# EAGLE design MotorController (EAGLE 9.5.2)
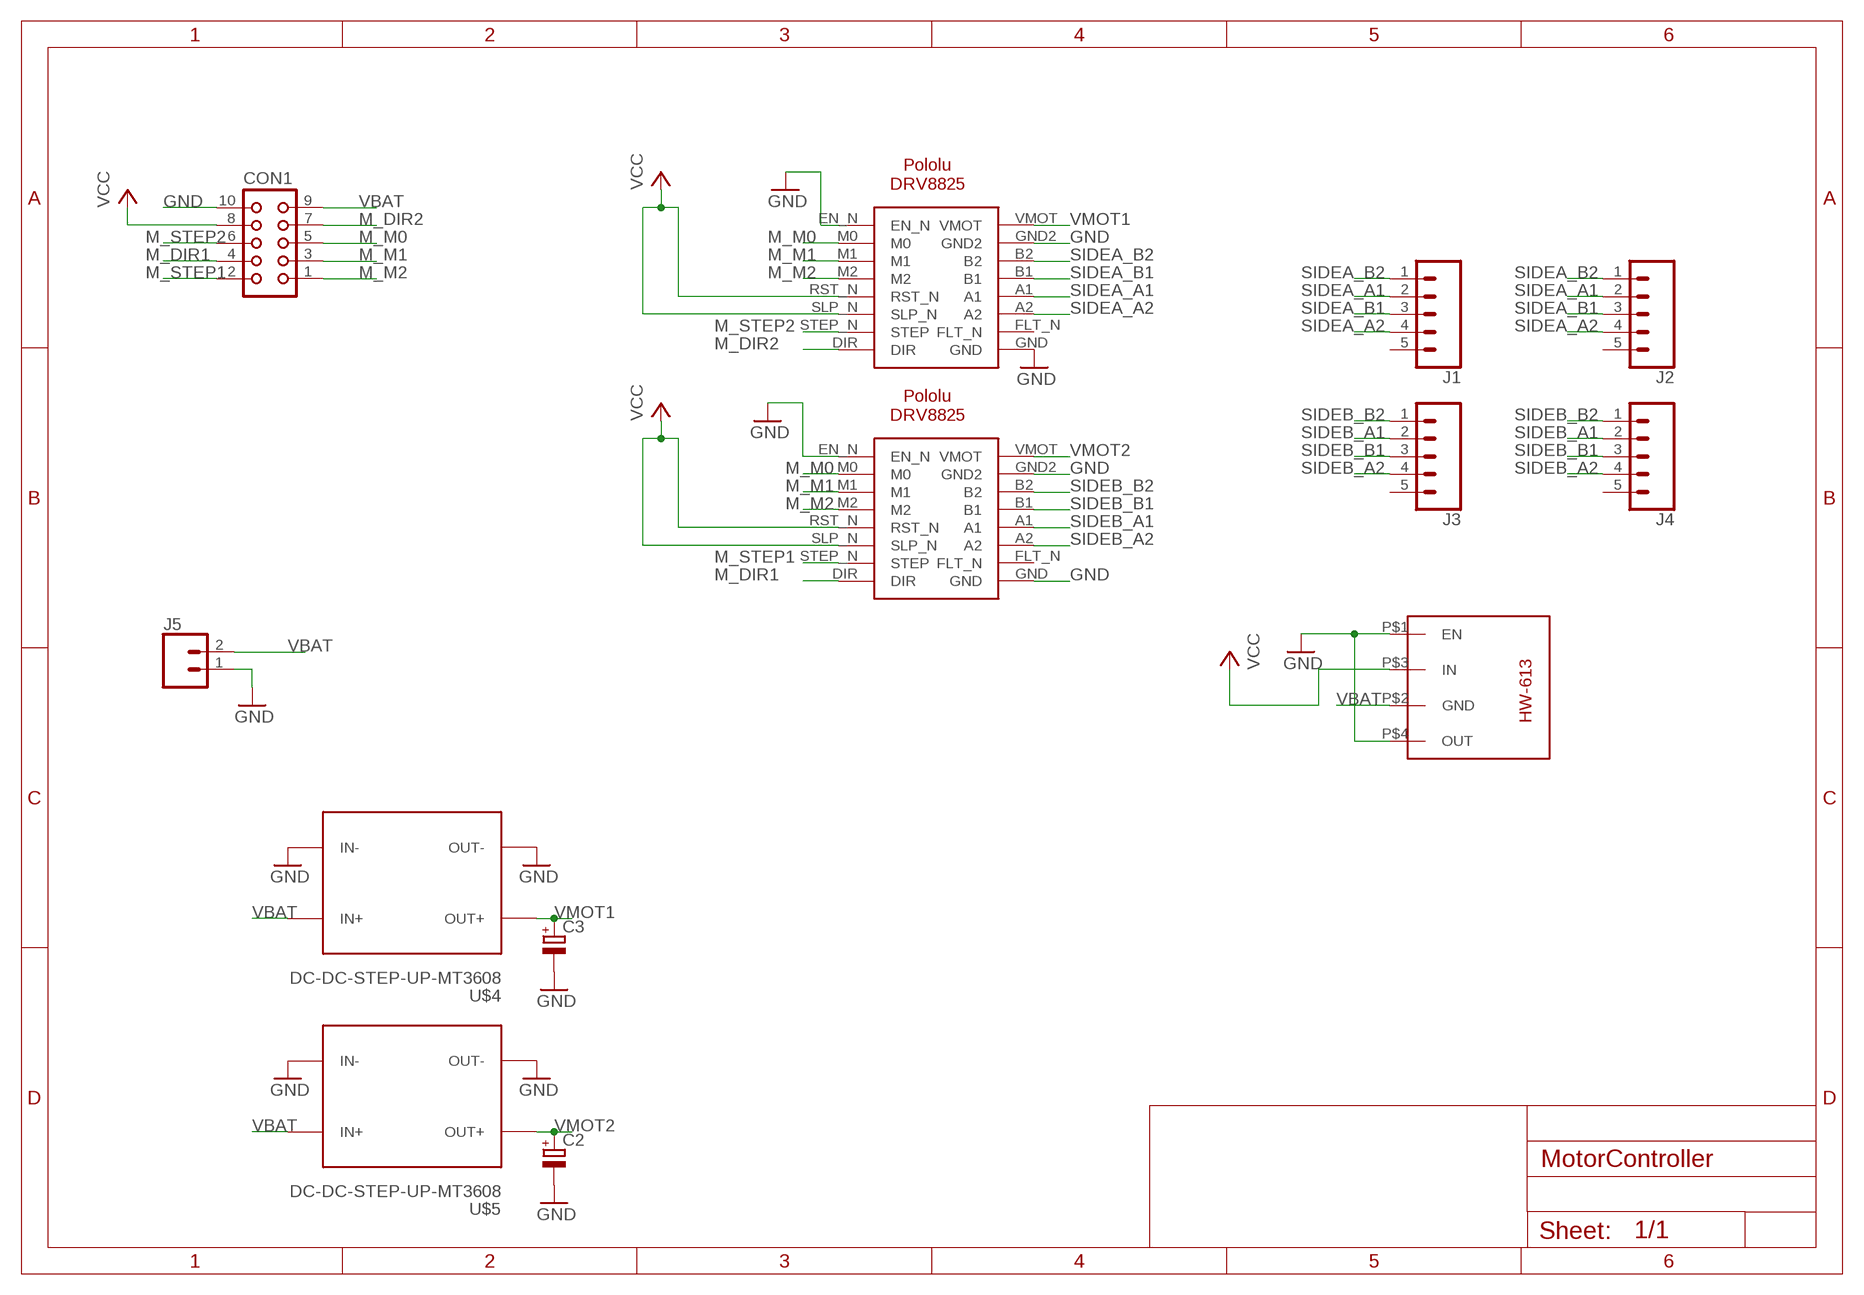
[diagram p0: schematic, sheet 1]

## Parts
C2  CPOL-EUE3.5-10  [E3,5-10]
C3  CPOL-EUE3.5-10  [E3,5-10]
CON1  CON10  [CON10]
J1  CONN_05  [1X05]
J2  CONN_05  [1X05]
J3  CONN_05  [1X05]
J4  CONN_05  [1X05]
J5  CONN_025MM  [SCREWTERMINAL-5MM-2]
U$1  POLOLU-DRV8825  [POLOLU-DRV8825]
U$2  POLOLU-DRV8825  [POLOLU-DRV8825]
U$4  DC-DC-STEP-UP-MT3608  [DC-DC-STEP-UP-MT3608]
U$5  DC-DC-STEP-UP-MT3608  [DC-DC-STEP-UP-MT3608]
U$6  HW-613  [HW-613]

## Nets
GND: C2.- C3.- CON1.10 J5.1 U$1.EN_N U$1.GND U$1.GND2 U$2.EN_N U$2.GND U$2.GND2 U$4.IN- U$4.OUT- U$5.IN- U$5.OUT- U$6.P$1(EN) U$6.P$4(OUT)
M_DIR1: CON1.4 U$2.DIR
M_DIR2: CON1.7 U$1.DIR
M_M0: CON1.5 U$1.M0 U$2.M0
M_M1: CON1.3 U$1.M1 U$2.M1
M_M2: CON1.1 U$1.M2 U$2.M2
M_STEP1: CON1.2 U$2.STEP_N(STEP)
M_STEP2: CON1.6 U$1.STEP_N(STEP)
SIDEA_A1: J1.2 J2.2 U$1.A1
SIDEA_A2: J1.4 J2.4 U$1.A2
SIDEA_B1: J1.3 J2.3 U$1.B1
SIDEA_B2: J1.1 J2.1 U$1.B2
SIDEB_A1: J3.2 J4.2 U$2.A1
SIDEB_A2: J3.4 J4.4 U$2.A2
SIDEB_B1: J3.3 J4.3 U$2.B1
SIDEB_B2: J3.1 J4.1 U$2.B2
VBAT: CON1.9 J5.2 U$4.IN+ U$5.IN+ U$6.P$2(GND)
VCC: CON1.8 U$1.RST_N U$1.SLP_N U$2.RST_N U$2.SLP_N U$6.P$3(IN)
VMOT1: C3.+ U$1.VMOT U$4.OUT+
VMOT2: C2.+ U$2.VMOT U$5.OUT+
Unconnected: J1.5 J2.5 J3.5 J4.5 U$1.FLT_N U$2.FLT_N

## Library data of the parts
C2 C3 = rcl:CPOL-EU: POLARIZED CAPACITOR, European symbol; SPICEPREFIX: C
CON1 = con-harting:CON10: CONNECTOR; OC_FARNELL: unknown; OC_NEWARK: unknown
J1-J4 = custom:CONN_05: Multi connection point. Often used as Generic Header-pin footprint for 0.1 inch spaced/style header connections On any of the 0.1 inch spaced packages, you can populate with these: Break Away Headers - Straight <https://www.sparkfun.com/products/116> (PRT-00116) Break Away Male Headers - Right Angle <https://www.sparkfun.com/products/553> (PRT-00553) Female Headers <https://www.sparkfun.com/products/115> (PRT-00115) Break Away Headers - Machine Pin <https://www.sparkfun.com/products/117> (PRT-00117) Break Away Female Headers - Swiss Machine Pin <https://www.sparkfun.com/products/743> (PRT-00743) For SCREWTERMINALS and SPRING TERMINALS visit here: Screw Terimnals on SparkFun.com <https://www.sparkfun.com/search/results?term=Screw+Terminals> (5mm/3.5mm/2.54mm spacing) This device is also useful as a general connection point to wire up your design to another part of your project. Our various solder wires solder well into these plated through hole pads. Hook-Up Wire - Assortment (Stranded, 22 AWG) <https://www.sparkfun.com/products/11375> (PRT-11375) Hook-Up Wire - Assortment (Solid Core, 22 AWG) <https://www.sparkfun.com/products/11367> (PRT-11367) View the entire wire category on our website here <https://www.sparkfun.com/categories/141> Special notes: Molex polarized connector foot print use with SKU : PRT-08231 with associated crimp pins and housings. 1MM SMD Version SKU: PRT-10208
J5 = SparkFun-Connectors:CONN_02: Multi connection point. Often used as Generic Header-pin footprint for 0.1 inch spaced/style header connections On any of the 0.1 inch spaced packages, you can populate with these: Break Away Headers - Straight <https://www.sparkfun.com/products/116> (PRT-00116) Break Away Male Headers - Right Angle <https://www.sparkfun.com/products/553> (PRT-00553) Female Headers <https://www.sparkfun.com/products/115> (PRT-00115) Break Away Headers - Machine Pin <https://www.sparkfun.com/products/117> (PRT-00117) Break Away Female Headers - Swiss Machine Pin <https://www.sparkfun.com/products/743> (PRT-00743) For SCREWTERMINALS and SPRING TERMINALS visit here: Screw Terimnals on SparkFun.com <https://www.sparkfun.com/search/results?term=Screw+Terminals> (5mm/3.5mm/2.54mm spacing) This device is also useful as a general connection point to wire up your design to another part of your project. Our various solder wires solder well into these plated through hole pads. Hook-Up Wire - Assortment (Stranded, 22 AWG) <https://www.sparkfun.com/products/11375> (PRT-11375) Hook-Up Wire - Assortment (Solid Core, 22 AWG) <https://www.sparkfun.com/products/11367> (PRT-11367) View the entire wire category on our website here <https://www.sparkfun.com/categories/141> Special notes: Molex polarized connector foot print use with: PRT-08233 with associated crimp pins and housings. 2.54_SCREWTERM for use with PRT-10571. 3.5mm Screw Terminal footprints for PRT-08084 5mm Screw Terminal footprints for use with PRT-08432; SF_SKU: PRT-08432
U$1 U$2 = alvarop-lib:POLOLU-DRV8825
U$4 U$5 = diy-modules:DC-DC-STEP-UP-MT3608: DC/DC Step-Up Regulator based on MT3608 chip MT3608 datasheet available here: https://www.olimex.com/Products/Breadboarding/BB-PWR-3608/resources/MT3608.pdf Click here to find device on ebay.com <http://www.ebay.com/sch/mt3608+module>
U$6 = mam2020:HW-613

## Board
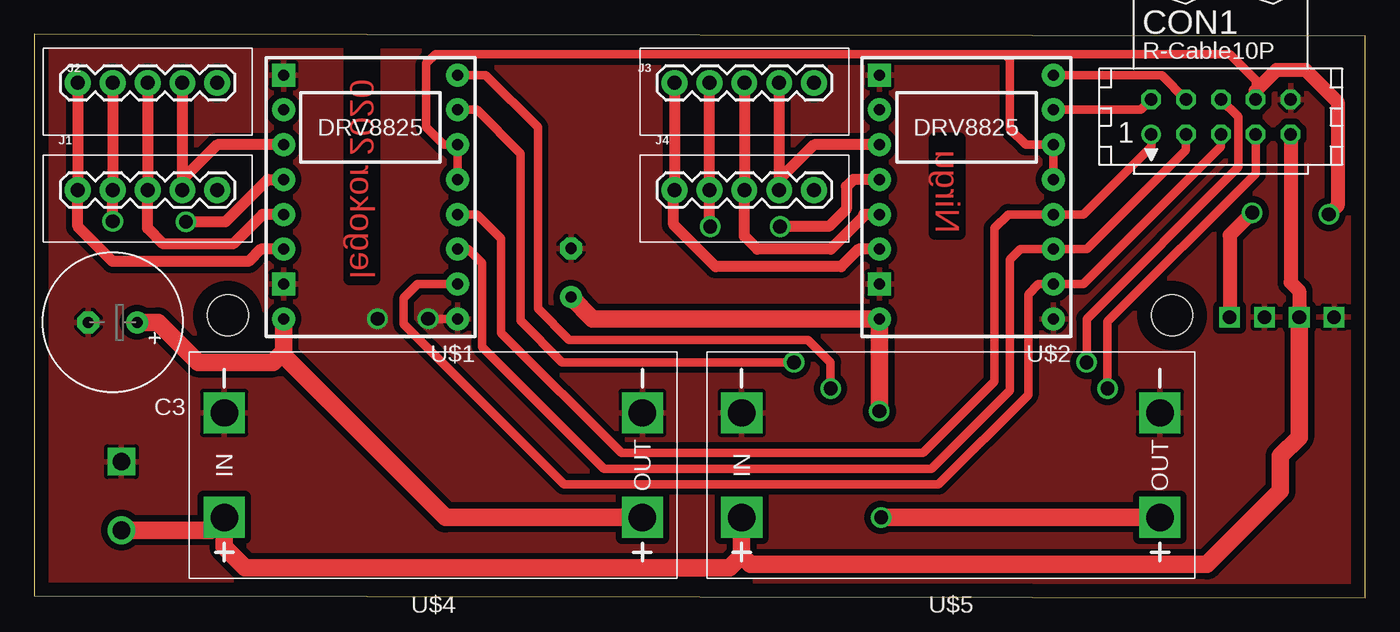
[diagram p1: board, top side]
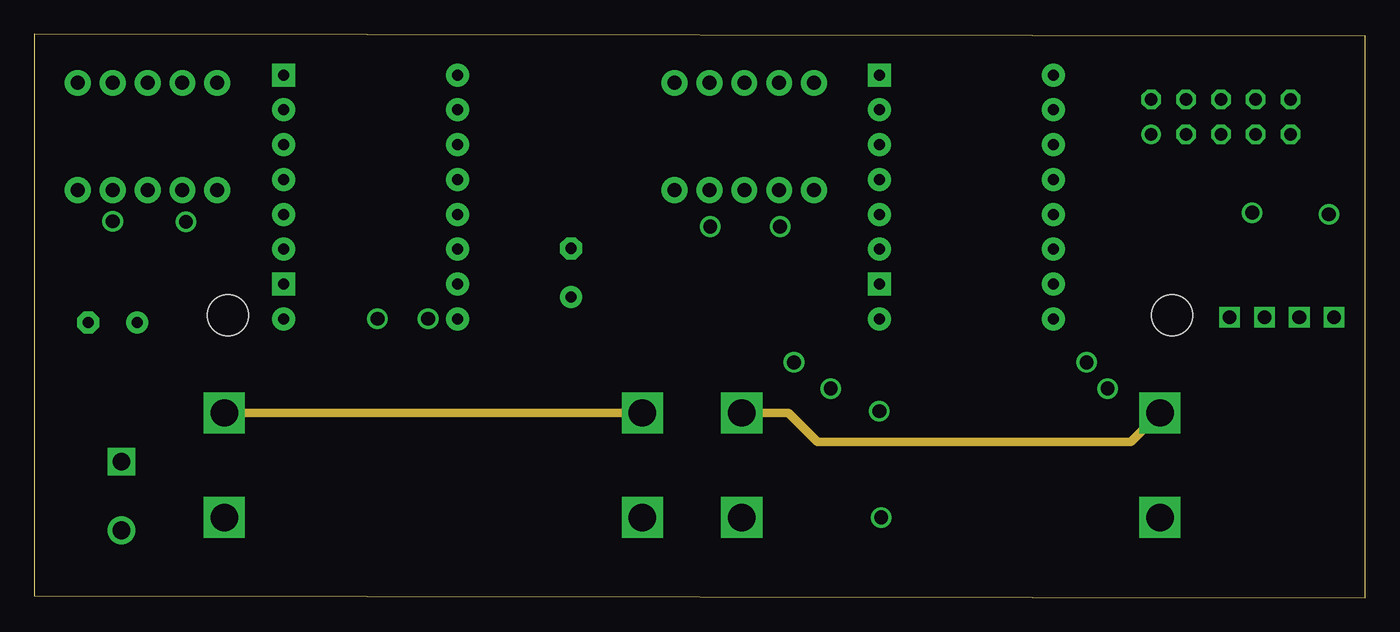
[diagram p2: board, inner layer Route15]
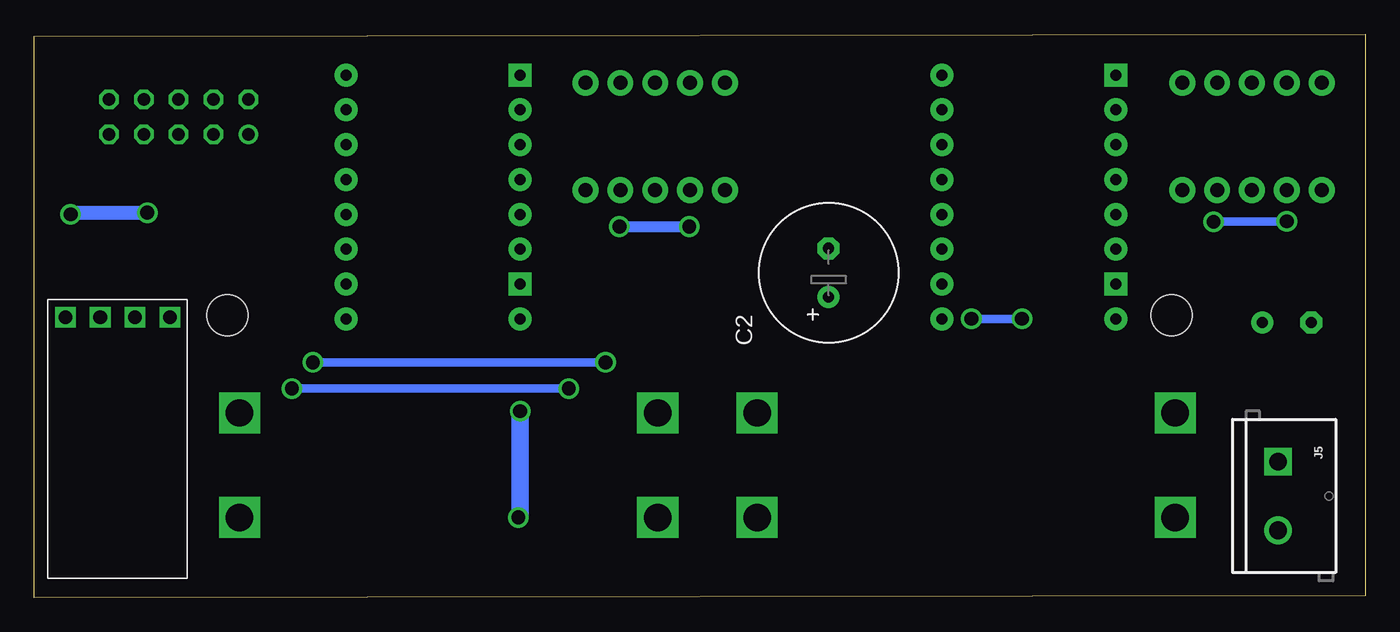
[diagram p3: board, bottom side, seen from below]

Size 97.01 x 41.07 mm. Coordinates in mm from the lower left corner, seen from the top.
Outline: 0,0.13 97.01,0 97.01,40.95 0,41.07 0,0.13
Copper layers (1+2*15+16): Top 0.035mm / dielectric 1.5mm / Route2 0.035mm / dielectric 0.15mm / Route15 0.035mm / dielectric 0.2mm / Bottom 0.035mm
Design rules "default *": minimum track width 6mil, minimum drill 0.35mm, track to track 18mil, track to pad 10mil, pad to pad 6mil, via to via 6mil, smd to smd 6mil, copper to edge 40mil, drill to drill 6mil, minimum pad ring 10mil, minimum via ring 8mil, stop-mask expansion 4mil, vias tented up to drill 0mil, thermal gap 10mil
Holes 3 mm at 14.1,20.57 82.93,20.57

### Footprints (pad centres in the part's own frame; a part is rotated, then mirrored left to right if it is on the bottom)
E3,5-10 = drill 0.813 pad 1.6: + -1.778,0 | drill 0.813 pad 1.6 octagon: - 1.778,0
CON10 = drill 0.914: 1 -5.08,-1.27 | drill 0.914 octagon: 2 -5.08,1.27; 3 -2.54,-1.27; 4 -2.54,1.27; 5 0,-1.27; 6 0,1.27; 7 2.54,-1.27; 8 2.54,1.27; 9 5.08,-1.27; 10 5.08,1.27
1X05 = drill 1.016 pad 1.88: 1 0,0; 2 2.54,0; 3 5.08,0; 4 7.62,0; 5 10.16,0
SCREWTERMINAL-5MM-2 = drill 1.3 pad 2.032 square: 1 0,0 | drill 1.3 pad 2.032: 2 5,0
POLOLU-DRV8825 = drill 0.8 pad 1.676: A1 6.35,-1.27; A2 6.35,-3.81; B1 6.35,1.27; B2 6.35,3.81; DIR -6.35,-8.89; EN_N -6.35,8.89; FLT_N 6.35,-6.35; M0 -6.35,6.35; M1 -6.35,3.81; M2 -6.35,1.27; RST_N -6.35,-1.27; SLP_N -6.35,-3.81; STEP_N -6.35,-6.35; VMOT 6.35,8.89 | drill 0.8 pad 1.676 square: GND 6.35,-8.89; GND2 6.35,6.35
DC-DC-STEP-UP-MT3608 = drill 2 pad 2.8 square: IN+ 15.24,3.81; IN- 15.24,-3.81; OUT+ -15.24,3.81; OUT- -15.24,-3.81
HW-613 = drill 1 square: P$1 0,1.27; P$2 0,-1.27; P$3 0,3.81; P$4 0,-3.81

### Placement (x,y rotation side)
C2  39.12,23.69 90 bottom
C3  5.71,20.07 180 top
CON1  86.49,35.05 0 top
J1  3.18,29.72 0 top
J2  3.18,37.53 0 top
J3  46.67,37.53 0 top
J4  46.67,29.72 0 top
J5  6.35,9.91 270 bottom
U$1  24.51,29.21 180 top
U$2  67.95,29.21 180 top
U$4  29.08,9.65 180 top
U$5  66.8,9.65 180 top
U$6  90.93,20.45 270 bottom

### Tracks (layer width: path | path; a pad name or v marks a point on that pad's centre or on a via)
GND  (via drill 1)
  Top 0.61: U$1.EN_N v28.7,20.32
  Route15 0.61: U$4.IN- U$4.OUT- | U$5.IN- 54.97,13.46 57.09,11.34 79.92,11.34 U$5.OUT-
  Bottom 0.61: v28.7,20.32 v25.02,20.32
  pour Top: 0.1,41.15 97.28,41.15 97.28,0.13 0,0.13 0,41.25
M_DIR1
  Top 0.61: CON1.4 82.17,38.1 U$2.DIR
M_DIR2  (via drill 1)
  Top 0.61: CON1.7 89.03,30.91 78.23,20.12 v78.23,15.24 | v58.04,15.24 58.04,17.14 56.39,18.8 38.99,18.8 36.7,21.08 36.7,34.29 32.89,38.1 U$1.DIR
  Bottom 0.61: v78.23,15.24 v58.04,15.24
M_M0
  Top 0.61: CON1.5 86.49,32.89 76.45,22.86 U$2.M0 73.2,22.86 72.44,22.1 72.44,14.78 65.91,8.26 38.61,8.26 26.92,19.94 26.92,21.84 27.94,22.86 U$1.M0
M_M1
  Top 0.61: CON1.3 83.95,32.64 76.71,25.4 U$2.M1 71.88,25.4 71.12,24.64 71.12,15.11 65.41,9.4 41.53,9.4 32.64,18.29 32.64,24.38 31.62,25.4 U$1.M1
M_M2
  Top 0.61: CON1.1 81.41,32.89 76.45,27.94 U$2.M2 70.99,27.94 69.98,26.92 69.98,15.75 64.77,10.54 42.8,10.54 34.04,19.3 34.04,26.16 32.26,27.94 U$1.M2
M_STEP1
  Top 0.61: U$2.STEP_N 80.64,35.56 CON1.2
M_STEP2  (via drill 1)
  Top 0.61: U$1.STEP_N 32.26,35.56 35.43,32.38 35.43,20.19 38.48,17.14 v55.37,17.14 | CON1.6 87.76,35.05 87.76,31.37 76.71,20.32 v76.71,17.14
  Bottom 0.61: v76.71,17.14 v55.37,17.14
SIDEA_A1  (via drill 1)
  Top 0.813: J2.2 J1.2 v5.71,27.43 | v11.05,27.4 13.94,27.4 17.02,30.48 U$1.A1
  Bottom 0.61: v11.05,27.4 5.75,27.4 v5.71,27.43
SIDEA_A2
  Top 0.813: J2.4 J1.4 10.79,30.48 13.34,33.02 U$1.A2
SIDEA_B1
  Top 0.813: J2.3 J1.3 8.25,26.92 9.4,25.78 14.48,25.78 16.64,27.94 U$1.B1
SIDEA_B2
  Top 0.813: J2.1 J1.1 3.18,27.05 5.71,24.51 15.62,24.51 16.51,25.4 U$1.B2
SIDEB_A1  (via drill 1)
  Top 0.813: J3.2 J4.2 49.21,27.11 v49.28,27.05 | U$2.A1 59.69,30.48 59.18,29.97 59.18,28.32 57.91,27.05 v54.36,27.05
  Bottom 0.813: v54.36,27.05 v49.28,27.05
SIDEB_A2
  Top 0.813: J3.4 54.29,30.48 | 54.29,30.48 J4.4 | U$2.A2 56.83,33.02 54.29,30.48
SIDEB_B1
  Top 0.813: J3.3 J4.3 51.75,26.35 52.71,25.4 58.06,25.4 60.45,27.8 60.45,27.94 U$2.B1
SIDEB_B2
  Top 0.813: J3.1 J4.1 46.61,29.65 46.61,27.18 49.66,24.13 58.8,24.13 60.07,25.4 U$2.B2
VBAT
  Top 1.016: CON1.9 91.57,22.99 92.2,22.35 U$6.P$2
  Top 1.27: 13.72,5.71 U$4.IN+ | U$4.IN+ 13.84,3.68 15.37,2.16 50.67,2.16 51.56,3.05 | U$5.IN+ 51.56,3.05 | 51.56,3.05 52.2,2.41 85.47,2.41 90.84,7.78 90.84,10.32 92.2,11.68 U$6.P$2 | U$4.IN+ 12.91,4.91 J5.2
VCC  (via drill 1)
  Top 0.61: 30.99,30.48 U$1.RST_N U$1.SLP_N 29.85,33.02 28.57,34.29 28.57,38.95 29.25,39.62 70.74,39.62 | 70.74,39.62 71.12,39.24 71.12,34.16 72.26,33.02 U$2.SLP_N U$2.RST_N | 70.74,39.62 87.12,39.62 89.03,37.72 CON1.8
  Top 1.016: CON1.8 89.03,36.96 90.55,38.48 92.64,38.48 95,36.13 95,28.57 v94.36,27.94 | v88.77,28.07 87.12,26.42 U$6.P$3
  Bottom 1.016: v94.36,27.94 94.36,28.07 v88.77,28.07
VMOT1
  Top 1.27: U$4.OUT+ 29.97,5.84 18.16,17.65 | 18.16,17.65 18.03,17.78 17.4,17.14 11.94,17.14 9.02,20.07 C3.+ | 18.16,17.65 U$1.VMOT
VMOT2  (via drill 1)
  Top 1.27: U$5.OUT+ v61.72,5.84 | v61.59,13.59 U$2.VMOT 40.7,20.32 C2.+
  Bottom 1.27: v61.72,5.84 61.59,5.97 v61.59,13.59

### Text on the board
Top: Nirgu | legokor 2020